# EAGLE design uprom2 (EAGLE 9.6.0)
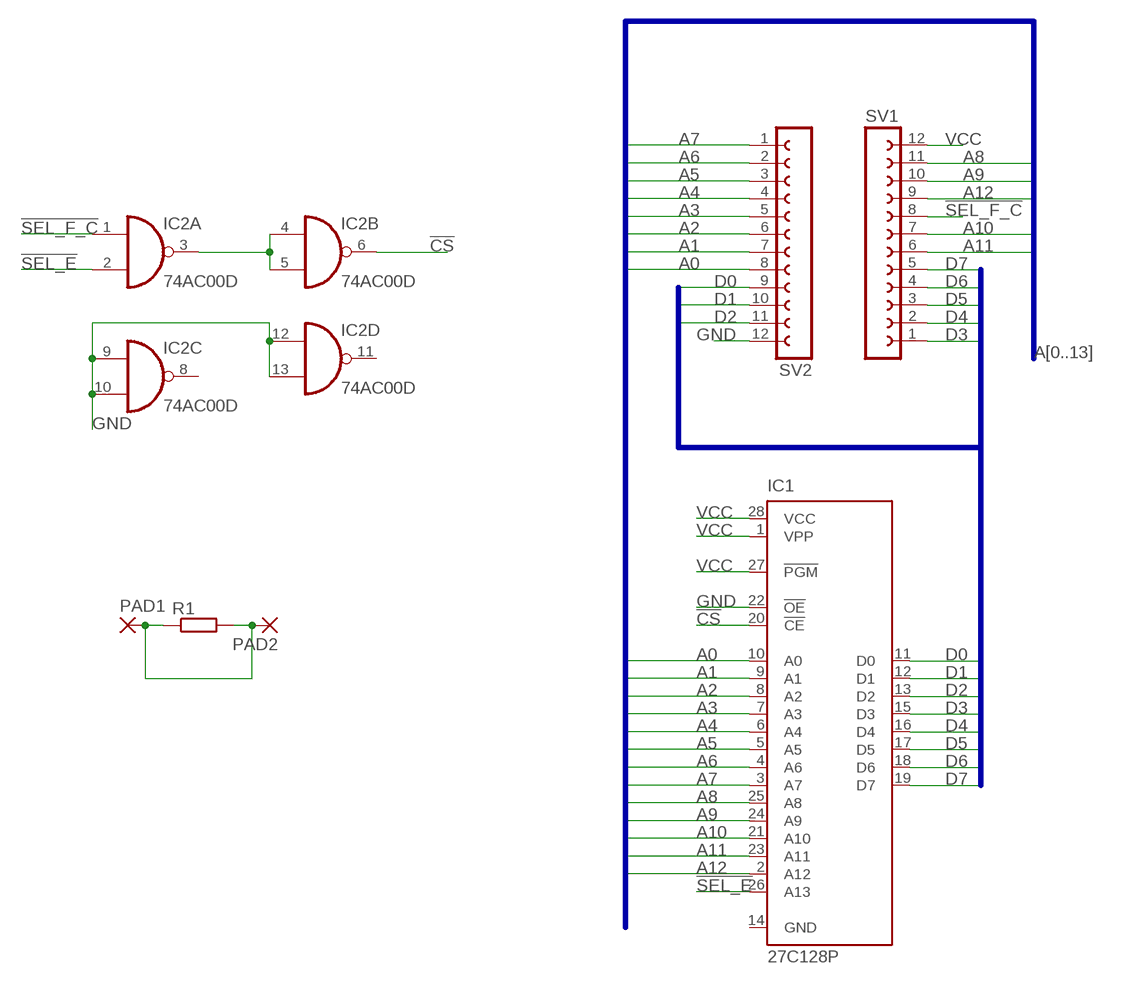
[diagram p0: schematic, sheet 1]

## Parts
IC1  27C128P  [DIL28-6]
IC2  74AC00D  [SO14]
PAD1  1,6/0,8  [1,6/0,8]
PAD2  1,6/0,8  [1,6/0,8]
R1  R-EU_R1206  [R1206]
SV1  FE12-1  [FE12]
SV2  FE12-1  [FE12]

## Nets
!CS: IC1.20(!CE) IC2.6(B:O)
!SEL_E: IC1.26(A13) IC2.2(A:I1)
!SEL_F_C: IC2.1(A:I0) SV1.8
A0: IC1.10(A0) SV2.8
A1: IC1.9(A1) SV2.7
A2: IC1.8(A2) SV2.6
A3: IC1.7(A3) SV2.5
A4: IC1.6(A4) SV2.4
A5: IC1.5(A5) SV2.3
A6: IC1.4(A6) SV2.2
A7: IC1.3(A7) SV2.1
A8: IC1.25(A8) SV1.11
A9: IC1.24(A9) SV1.10
A10: IC1.21(A10) SV1.7
A11: IC1.23(A11) SV1.6
A12: IC1.2(A12) SV1.9
D0: IC1.11(D0) SV2.9
D1: IC1.12(D1) SV2.10
D2: IC1.13(D2) SV2.11
D3: IC1.15(D3) SV1.1
D4: IC1.16(D4) SV1.2
D5: IC1.17(D5) SV1.3
D6: IC1.18(D6) SV1.4
D7: IC1.19(D7) SV1.5
GND: IC1.22(!OE) IC2.9(C:I0) IC2.10(C:I1) IC2.12(D:I0) IC2.13(D:I1) PAD1.1(P) PAD2.1(P) R1.1 R1.2 SV2.12
N$4: IC2.3(A:O) IC2.4(B:I0) IC2.5(B:I1)
VCC: IC1.1(VPP) IC1.27(!PGM) IC1.28(VCC) SV1.12
Unconnected: IC2.8(C:O) IC2.11(D:O)

## Buses
A[0..13]
D[0..7]

## Power pins joined to a net without a drawn wire
GND: IC1.14(GND) IC2.7(P:GND)
VCC: IC2.14(P:VCC)

## Library data of the parts
IC1 = microchip:27*128: CMOS EPROM 128 K (16 K x 8); OC_FARNELL: unknown; OC_NEWARK: unknown
IC2 = 74xx-eu:74*00: Quad 2-input NAND gate
PAD1 PAD2 = wirepad:1,6/0,8: THROUGH-HOLE PAD
R1 = rcl:R-EU_: RESISTOR, European symbol; SPICEPREFIX: R
SV1 SV2 = con-lsta:FE12-1: FEMALE HEADER; OC_FARNELL: unknown; OC_NEWARK: unknown

## Board
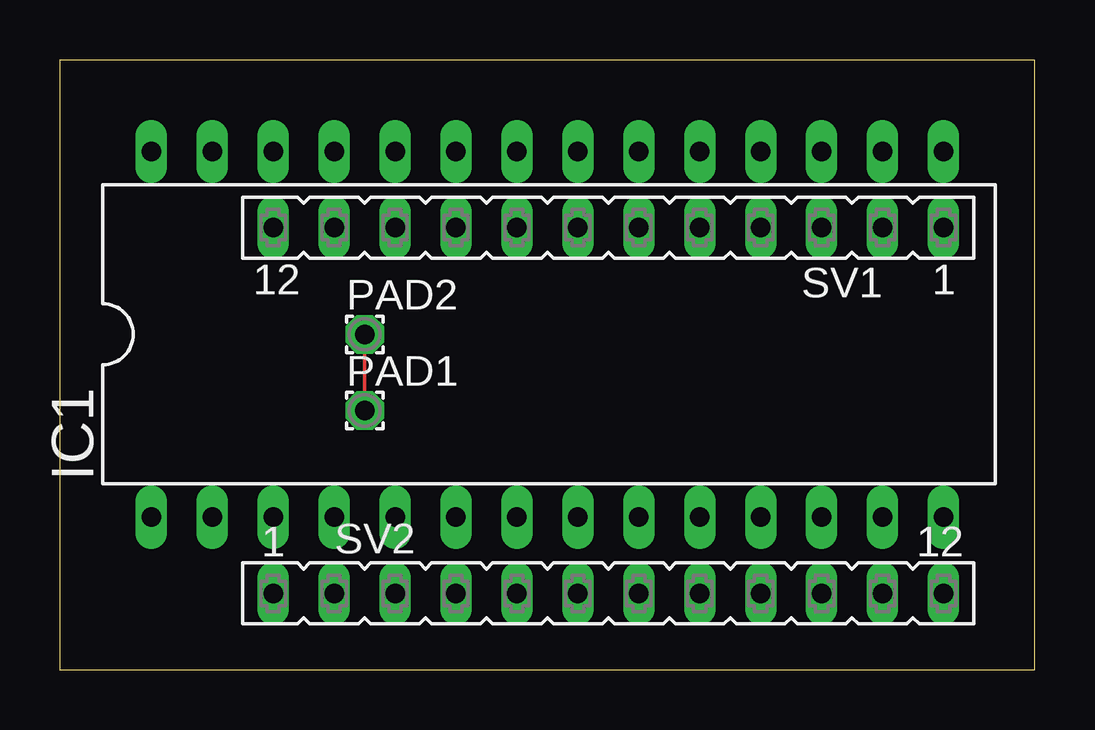
[diagram p1: board, top side]
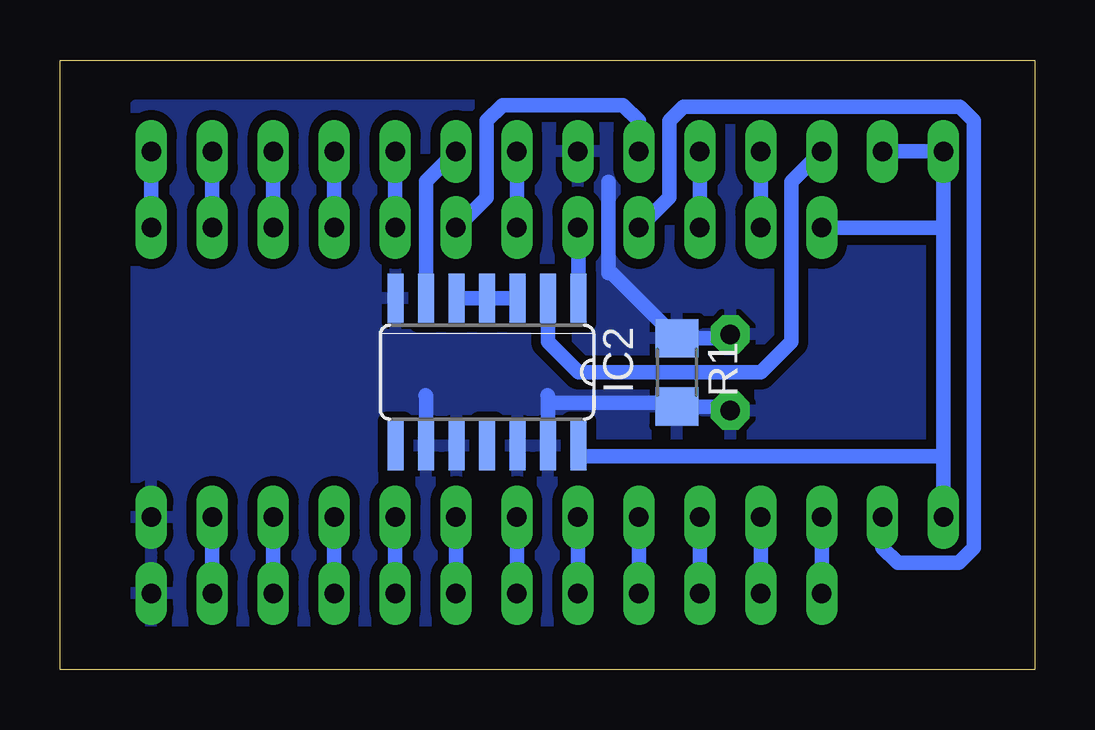
[diagram p2: board, bottom side, seen from below]

Size 40.64 x 25.4 mm. Coordinates in mm from the lower left corner, seen from the top.
Outline: 0,0 40.64,0 40.64,25.4 0,25.4 0,0
Copper layers (1*16): Top 0.035mm / dielectric 1.5mm / Bottom 0.035mm
Design rules "default": minimum track width 6mil, minimum drill 0.35mm, track to track 6mil, track to pad 6mil, pad to pad 6mil, via to via 6mil, smd to smd 6mil, copper to edge 40mil, drill to drill 6mil, minimum pad ring 10mil, minimum via ring 8mil, stop-mask expansion 4mil, vias tented up to drill 0mil, thermal gap 10mil

### Footprints (pad centres in the part's own frame; a part is rotated, then mirrored left to right if it is on the bottom)
DIL28-6 = drill 0.813 long: 1 -16.51,-7.62; 2 -13.97,-7.62; 3 -11.43,-7.62; 4 -8.89,-7.62; 5 -6.35,-7.62; 6 -3.81,-7.62; 7 -1.27,-7.62; 8 1.27,-7.62; 9 3.81,-7.62; 10 6.35,-7.62; 11 8.89,-7.62; 12 11.43,-7.62; 13 13.97,-7.62; 14 16.51,-7.62; 15 16.51,7.62; 16 13.97,7.62; 17 11.43,7.62; 18 8.89,7.62; 19 6.35,7.62; 20 3.81,7.62; 21 1.27,7.62; 22 -1.27,7.62; 23 -3.81,7.62; 24 -6.35,7.62; 25 -8.89,7.62; 26 -11.43,7.62; 27 -13.97,7.62; 28 -16.51,7.62
SO14 = smd 0.66 x 2.032: 1 -3.81,-3.073; 2 -2.54,-3.073; 3 -1.27,-3.073; 4 0,-3.073; 5 1.27,-3.073; 6 2.54,-3.073; 7 3.81,-3.073; 8 3.81,3.073; 9 2.54,3.073; 10 1.27,3.073; 11 0,3.073; 12 -1.27,3.073; 13 -2.54,3.073; 14 -3.81,3.073
1,6/0,8 = drill 0.813 pad 1.6 octagon: 1 0,0
R1206 = smd 1.6 x 1.803: 1 -1.422,0; 2 1.422,0
FE12 = drill 0.813 long: 1 -13.97,0; 2 -11.43,0; 3 -8.89,0; 4 -6.35,0; 5 -3.81,0; 6 -1.27,0; 7 1.27,0; 8 3.81,0; 9 6.35,0; 10 8.89,0; 11 11.43,0; 12 13.97,0

### Placement (x,y rotation side)
IC1  20.32,13.97 0 top
IC2  22.83,12.4 180 bottom
PAD1  12.7,10.8 0 top
PAD2  12.7,13.97 0 top
R1  14.92,12.38 270 bottom
SV1  22.86,18.42 180 top
SV2  22.86,3.17 0 top

### Tracks (layer width: path | path; a pad name or v marks a point on that pad's centre or on a via)
!CS
  Bottom 0.61: IC2.6 25.38,20.34 IC1.20
!SEL_E
  Bottom 0.61: 20.32,15.44 IC2.2 20.29,13.65 19.02,12.38 11.43,12.38 10.16,13.65 10.16,20.32 IC1.26
!SEL_F_C
  Bottom 0.61: IC2.1 19.02,18.39 SV1.8
A0
  Bottom 0.61: IC1.10 SV2.8
A1
  Bottom 0.61: SV2.7 IC1.9
A2
  Bottom 0.61: IC1.8 SV2.6
A3
  Bottom 0.61: SV2.5 IC1.7
A4
  Bottom 0.61: IC1.6 SV2.4
A5
  Bottom 0.61: SV2.3 IC1.5
A6
  Bottom 0.61: IC1.4 SV2.2
A7
  Bottom 0.61: SV2.1 IC1.3
A8
  Bottom 0.61: IC1.25 SV1.11
A9
  Bottom 0.61: SV1.10 IC1.24
A10
  Bottom 0.61: IC1.21 SV1.7
A11
  Bottom 0.61: IC1.23 16.51,22.86 17.17,23.52 22.2,23.52 22.86,22.86 22.86,19.66 24.1,18.42 SV1.6
A12
  Bottom 0.61: SV1.9 15.24,19.69 15.24,22.86 14.66,23.44 3.12,23.44 2.54,22.86 2.54,5.08 3.17,4.45 5.71,4.45 6.35,5.08 IC1.2
D0
  Bottom 0.61: SV2.9 IC1.11
D1
  Bottom 0.61: IC1.12 SV2.10
D2
  Bottom 0.61: SV2.11 IC1.13
D3
  Bottom 0.61: SV1.1 IC1.15
D4
  Bottom 0.61: IC1.16 SV1.2
D5
  Bottom 0.61: SV1.3 IC1.17
D6
  Bottom 0.61: IC1.18 SV1.4
D7
  Bottom 0.61: SV1.5 IC1.19
GND
  Top 0.152: PAD2.1 PAD1.1
  Bottom 0.61: IC2.13 20.29,11.11 | 20.29,11.11 20.29,11.41 20.32,11.43 | IC2.9 25.38,11.41 25.4,11.43 | 20.29,11.11 15.56,11.11 15.4,10.96 R1.2 12.87,10.96 PAD1.1 | 17.78,20.32 17.78,16.51 17.63,16.51 R1.1 12.87,13.81 PAD2.1
  pour Bottom (isolate 0.406): 2.54,2.06 2.54,23.5 37.46,23.5 37.46,2.06
N$4
  Bottom 0.61: IC2.5 IC2.4 IC2.3
VCC
  Bottom 0.61: IC1.27 IC1.28 3.81,18.42 | 3.81,8.89 3.81,18.42 | SV1.12 3.81,18.42 | IC2.14 19.02,9 18.91,8.89 3.81,8.89 | 3.81,8.89 IC1.1